# EAGLE design uart (EAGLE 7.6.0)
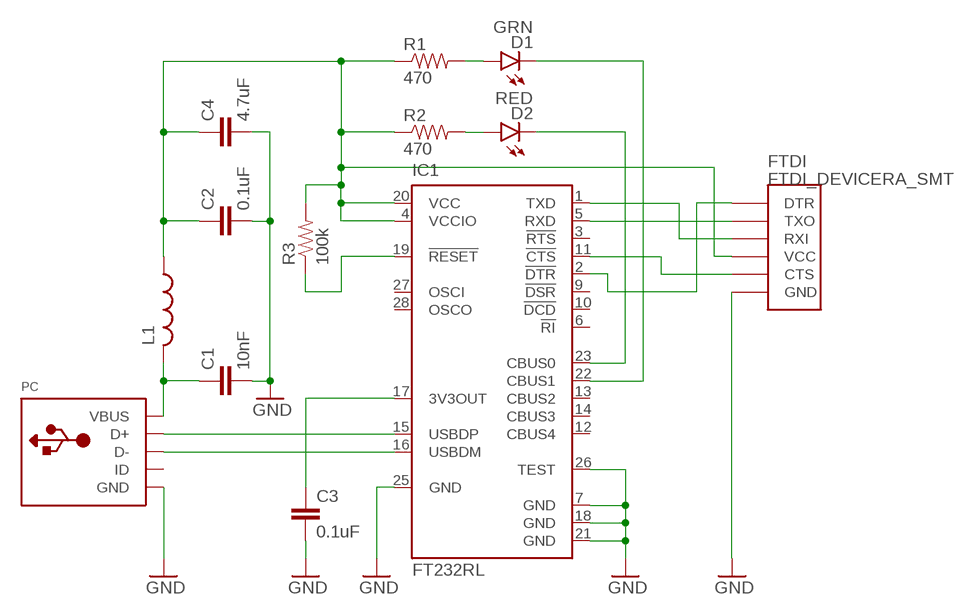
[diagram p0: schematic, sheet 1]

## Parts
C1  10nF  10NF/10000PF-50V-10%(0603)  [0603-CAP]
C2  0.1uF  0.1UF-25V-5%(0603)  [0603-CAP]
C3  0.1uF  0.1UF-25V-5%(0603)  [0603-CAP]
C4  4.7uF  4.7UF-6.3V-10%(0603)0603  [0603-CAP]
D1  GRN  LED-GREEN0603  [LED-0603]
D2  RED  LED-RED0603  [LED-0603]
FTDI  FTDI_DEVICERA_SMT  [FTDI_DEVICE_RA_SMT]
IC1  FT232RL  [SSOP28]
L1  L-USL2012C  [L2012C]
PC  USBMINIB  [USB-MINIB]
R1  470  470OHM1/10W1%(0603)  [0603-RES]
R2  470  470OHM1/10W1%(0603)  [0603-RES]
R3  100k  100KOHM-1/10W-1%(0603)  [0603-RES]

## Nets
GND: C1.2 C2.2 C3.2 C4.2 FTDI.6(GND) IC1.7(GND) IC1.18(GND) IC1.21(GND) IC1.25(GND) IC1.26(TEST) PC.GND
N$1: IC1.15(USBDP) PC.D+
N$2: IC1.16(USBDM) PC.D-
N$3: C3.1 IC1.17(3V3OUT)
N$4: FTDI.5(CTS) IC1.11(!CTS)
N$5: FTDI.1(DTR) IC1.2(!DTR)
N$6: IC1.19(!RESET) R3.1
N$7: C2.1 C4.1 FTDI.4(VCC) IC1.4(VCCIO) IC1.20(VCC) L1.1 R1.1 R2.1 R3.2
N$10: D2.C IC1.23(CBUS0)
N$11: D2.A R2.2
N$12: D1.A R1.2
N$13: D1.C IC1.22(CBUS1)
N$14: C1.1 L1.2 PC.VBUS
N$16: FTDI.3(RXI) IC1.1(TXD)
N$17: FTDI.2(TXO) IC1.5(RXD)
Unconnected: IC1.3(!RTS) IC1.6(!RI) IC1.9(!DSR) IC1.10(!DCD) IC1.12(CBUS4) IC1.13(CBUS2) IC1.14(CBUS3) IC1.27(OSCI) IC1.28(OSCO) PC.ID

## Library data of the parts
C1 = SparkFun-Capacitors:10NF/10000PF-50V-10%(0603): CAP-00867; MPN: C0603C103J1RACTU; OC_NEWARK: 76Y2901; PROD_ID: CAP-00867
C2 C3 = SparkFun-Capacitors:0.1UF-25V-5%(0603): CAP-08604; MPN: C0603C104K4RAC7081; OC_NEWARK: 76Y2903; PROD_ID: CAP-08604
C4 = SparkFun-Capacitors:4.7UF-6.3V-10%(0603): CAP-08280; MPN: 0603F475Z100CT; OC_NEWARK: 78Y5262; PROD_ID: CAP-08280
D1 = SparkFun-LED:LED-GREEN: Various green LEDs Green LEDs used in SFE Production 0603- DIO-00821 LARGE- DIO-00862 LILYPAD- DIO-09910; MPN: HSME-C191; OC_NEWARK: 05M0345; PROD_ID: DIO-00821; VALUE: GREEN
D2 = SparkFun-LED:LED-RED: Assorted Red LEDs LilyPad 1206- DIO-09912 1206- DIO-00809 0603- DIO-00819 "SMART" means more efficient and expensive; MPN: HSMC-C120; OC_NEWARK: 97K1631; PROD_ID: DIO-00819
FTDI = SparkFun-Connectors:FTDI_DEVICE: Connector which mates to FTDI basic or FTDI cable.; OC_NEWARK: unknown; PROD_ID: CONN-08971
IC1 = ftdichip:FT232R: Source: http://www.ftdichip.com/Documents/DataSheets/DS_FT232R_v104.pdf; MPN: FT232RL-REEL; OC_FARNELL: 1146032; OC_NEWARK: 91K9918
L1 = rcl:L-US: INDUCTOR, American symbol; MPN: 744052180; OC_NEWARK: 44W4543
PC = adafruit:USB: USB Connectors USBMINIB - Surface Mount Female Mini-B USB Connector 4UConnector: 06564 By microbuilder.eu Thru-hole RA Female Mini-B USB Connector 4UConnector: 18732 By ladyada.net; MPN: MUSB-B5-S-RA-TSMT-CS1; OC_NEWARK: 71Y7363
R1 R2 = SparkFun-Resistors:470OHM1/10W1%(0603): RES-07869; MPN: ERJ-P03F4700V; OC_NEWARK: 05X8640; PROD_ID: RES-07869
R3 = SparkFun-Resistors:100KOHM-1/10W-1%(0603): RES-07828; MPN: ERA-3AEB104V; OC_NEWARK: 08N2096; PROD_ID: RES-07828

## Net classes
0 default: width 0.305 mm, drill 0.508 mm, clearance 0.254 mm

## Board
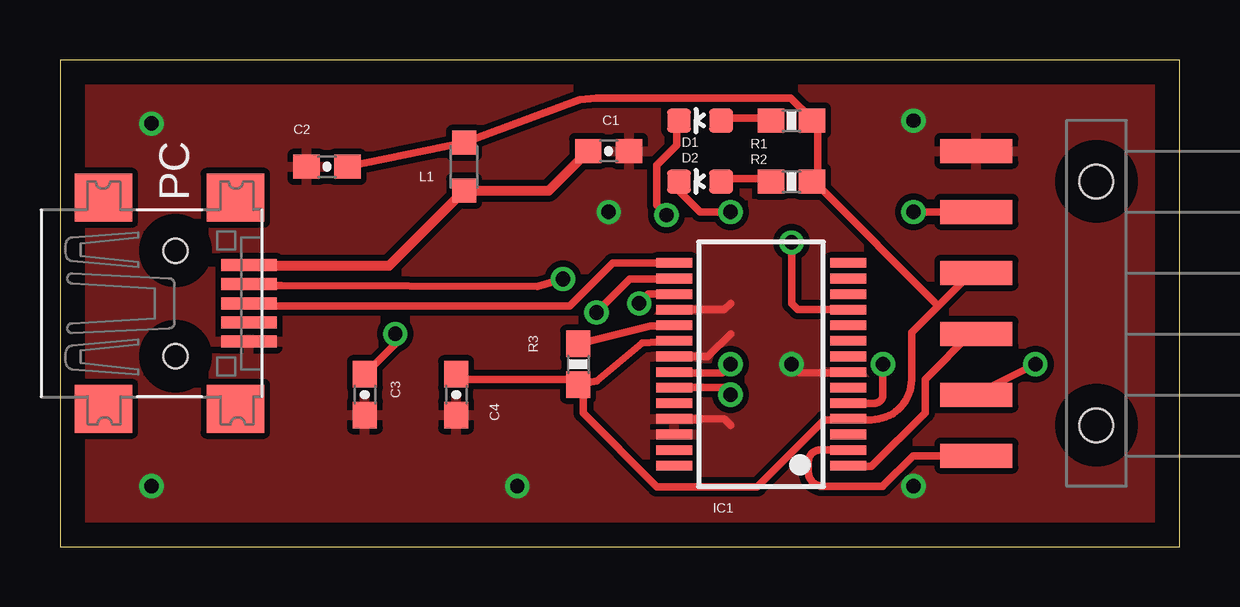
[diagram p1: board, top side]
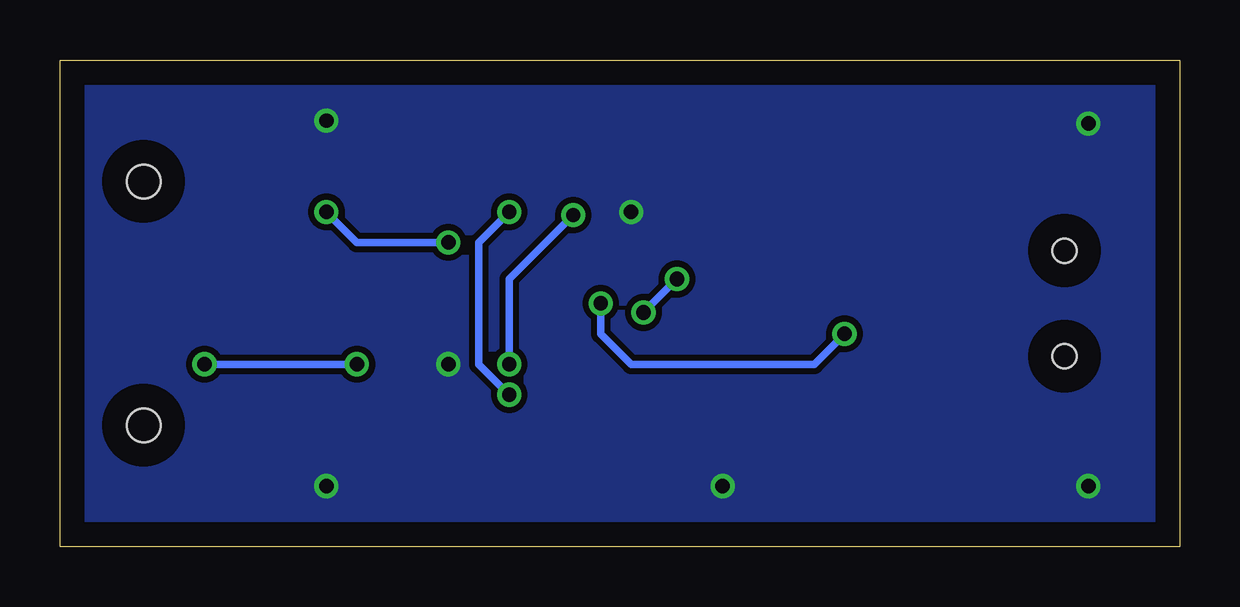
[diagram p2: board, bottom side, seen from below]

Size 46.66 x 20.31 mm. Coordinates in mm from the lower left corner, seen from the top.
Outline: 0,0 46.66,0 46.66,20.31 0,20.31 0,0
Copper layers (1*16): Top 0.035mm / dielectric 1.5mm / Bottom 0.035mm
Design rules "default *": minimum track width 10mil, minimum drill 20mil, track to track 8mil, track to pad 8mil, pad to pad 8mil, via to via 8mil, smd to smd 8mil, copper to edge 40mil, drill to drill 8mil, minimum pad ring 10mil, minimum via ring 8mil, stop-mask expansion 4mil, vias tented up to drill 0mil, thermal gap 10mil

### Footprints (pad centres in the part's own frame; a part is rotated, then mirrored left to right if it is on the bottom)
0603-CAP = smd 1.1 x 1: 1 -0.85,0; 2 0.85,0
LED-0603 = smd 1 x 1: A 0,-0.877; C 0,0.877
FTDI_DEVICE_RA_SMT = smd 1 x 3: 1 -6.35,5; 2 -3.81,5; 3 -1.27,5; 4 1.27,5; 5 3.81,5; 6 6.35,5 | hole 1.4: -5.08,0; 5.08,0
SSOP28 = smd 0.4 x 1.5: 1 -4.225,-3.625; 2 -3.575,-3.625; 3 -2.925,-3.625; 4 -2.275,-3.625; 5 -1.625,-3.625; 6 -0.975,-3.625; 7 -0.325,-3.625; 8 0.325,-3.625; 9 0.975,-3.625; 10 1.625,-3.625; 11 2.275,-3.625; 12 2.925,-3.625; 13 3.575,-3.625; 14 4.225,-3.625; 15 4.225,3.625; 16 3.575,3.625; 17 2.925,3.625; 18 2.275,3.625; 19 1.625,3.625; 20 0.975,3.625; 21 0.325,3.625; 22 -0.325,3.625; 23 -0.975,3.625; 24 -1.625,3.625; 25 -2.275,3.625; 26 -2.925,3.625; 27 -3.575,3.625; 28 -4.225,3.625
L2012C = smd 1 x 1: 1 -1,0; 2 1,0
USB-MINIB = smd 0.5 x 2.308: D+ 0,4.064; D- -0.8,4.064; GND 1.6,4.064; ID 0.8,4.064; VBUS -1.6,4.064 | smd 2 x 2.4: GND1 -4.4,-2; GND2 -4.4,3.5; GND3 4.4,3.5; GND4 4.4,-2 | hole 1: -2.2,1; 2.2,1
0603-RES = smd 1.1 x 1: 1 -0.85,0; 2 0.85,0

### Placement (x,y rotation side)
C1  22.86,16.51 0 top
C2  11.13,15.86 180 top
C3  12.7,6.35 270 top
C4  16.51,6.35 270 top
D1  26.67,17.78 90 top
D2  26.67,15.24 90 top
FTDI  43.18,10.16 90 top
IC1  29.21,7.62 90 top
L1  16.84,15.86 270 top
PC  3.81,10.16 270 top
R1  30.48,17.78 180 top
R2  30.48,15.24 180 top
R3  21.59,7.62 270 top

### Tracks (layer width: path | path; a pad name or v marks a point on that pad's centre or on a via)
GND  (via drill 0.6)
  Top 0.305: 25.7,5.31 26.54,5.31 | IC1.7 32.69,7.26 30.84,7.26 v30.48,7.62 | 25.7,5.31 25.59,5.34 27.68,5.34 27.94,5.08 | 25.7,5.31 IC1.25 | IC1.18 27.68,9.89 27.94,10.16 | IC1.21 27,7.95 27.94,8.89
  other vias: 3.81,2.54 19.05,2.54 35.56,2.54 35.56,17.78 22.86,13.97 3.81,17.66
  pour Top: 0,20.32 45.72,20.32 45.72,0 0,0
  pour Bottom: 0,20.32 0,0 45.72,0 45.72,20.32
N$1
  Top 0.305: PC.D+ 8.1,10.06 21.23,10.06 23.02,11.85 IC1.15
N$2  (via drill 0.61)
  Top 0.305: v22.35,9.78 23.75,11.18 25.43,11.18 IC1.16 | v20.95,11.18 19.89,10.86 9.22,10.9 8.1,10.9 PC.D-
  Bottom 0.305: v20.95,11.18 v22.35,9.78
N$3  (via drill 0.6)
  Top 0.305: IC1.17 24.52,10.54 v24.13,10.16 | v13.97,8.89 13.97,8.47 C3.1
  Bottom 0.305: v24.13,10.16 24.13,8.89 22.86,7.62 15.24,7.62 v13.97,8.89
N$4  (via drill 0.6)
  Top 0.305: IC1.11 30.75,9.89 30.48,10.16 v30.48,12.7 | v35.56,13.97 FTDI.5
  Bottom 0.305: v30.48,12.7 34.29,12.7 v35.56,13.97
N$5
  Top 0.305: IC1.2 31.67,4.04 arc90 31.18,3.56 31.18,3.15 arc90 31.81,2.52 34.27,2.52 arc90 34.29,2.54 35.56,3.81 FTDI.1
N$6
  Top 0.305: 21.79,8.66 R3.1 24.59,9.22 25.43,9.22 IC1.19
N$7
  Top 0.305: C4.1 16.76,6.99 21.51,6.99 R3.2 | C2.1 L1.1 21.66,18.65 22.35,18.72 30.45,18.72 31.29,17.88 R1.1 31.57,17.6 31.57,15.37 R2.1 31.57,15.09 36.6,10.06 | 36.6,10.06 38,11.46 FTDI.4 | 36.6,10.06 35.48,8.94 35.48,6.99 arc-90 33.81,5.31 32.97,5.31 IC1.4 32.69,5.31 31.85,5.31 29.06,2.52 24.87,2.52 21.79,5.59 21.79,6.71 R3.2 | R3.2 22.36,6.93 24.25,8.5 IC1.20
N$10  (via drill 0.6)
  Top 0.305: D2.C 25.79,14.85 26.67,13.97 v27.94,13.97 | v27.94,6.35 27.64,6.64 IC1.23
  Bottom 0.305: v27.94,13.97 29.21,12.7 29.21,7.62 v27.94,6.35
N$11
  Top 0.305: D2.A 27.66,15.37 29.62,15.37 R2.2
N$12
  Top 0.305: D1.A 27.66,17.88 29.62,17.88 R1.2
N$13  (via drill 0.6)
  Top 0.305: D1.C 25.7,17.6 25.7,16.76 24.87,15.93 24.87,14.25 v25.27,13.84 | IC1.22 25.7,7.26 27.58,7.26 v27.94,7.62
  Bottom 0.305: v27.94,7.62 27.94,11.18 v25.27,13.84
N$14
  Top 0.305: 21.79,16.48 C1.1 | 8.1,11.73 PC.VBUS
  Top 0.406: 8.1,11.73 13.71,11.73 L1.2 20.36,14.86 C1.1
N$16
  Top 0.305: IC1.1 32.97,3.35 33.81,3.35 36.04,5.59 36.04,6.99 38,8.94 FTDI.3
N$17  (via drill 0.6)
  Top 0.305: IC1.5 33.94,6 arc90 34.29,6.35 v34.29,7.62 | v40.64,7.62 38.1,6.35 FTDI.2
  Bottom 0.305: v34.29,7.62 v40.64,7.62

### Text on the board
tValues: RX | GND | TX | CTS | VCC | TXD | RXD | DTR | Maciek's FTDI v1.0